# Altium project PCB_projektas.PrjPcb
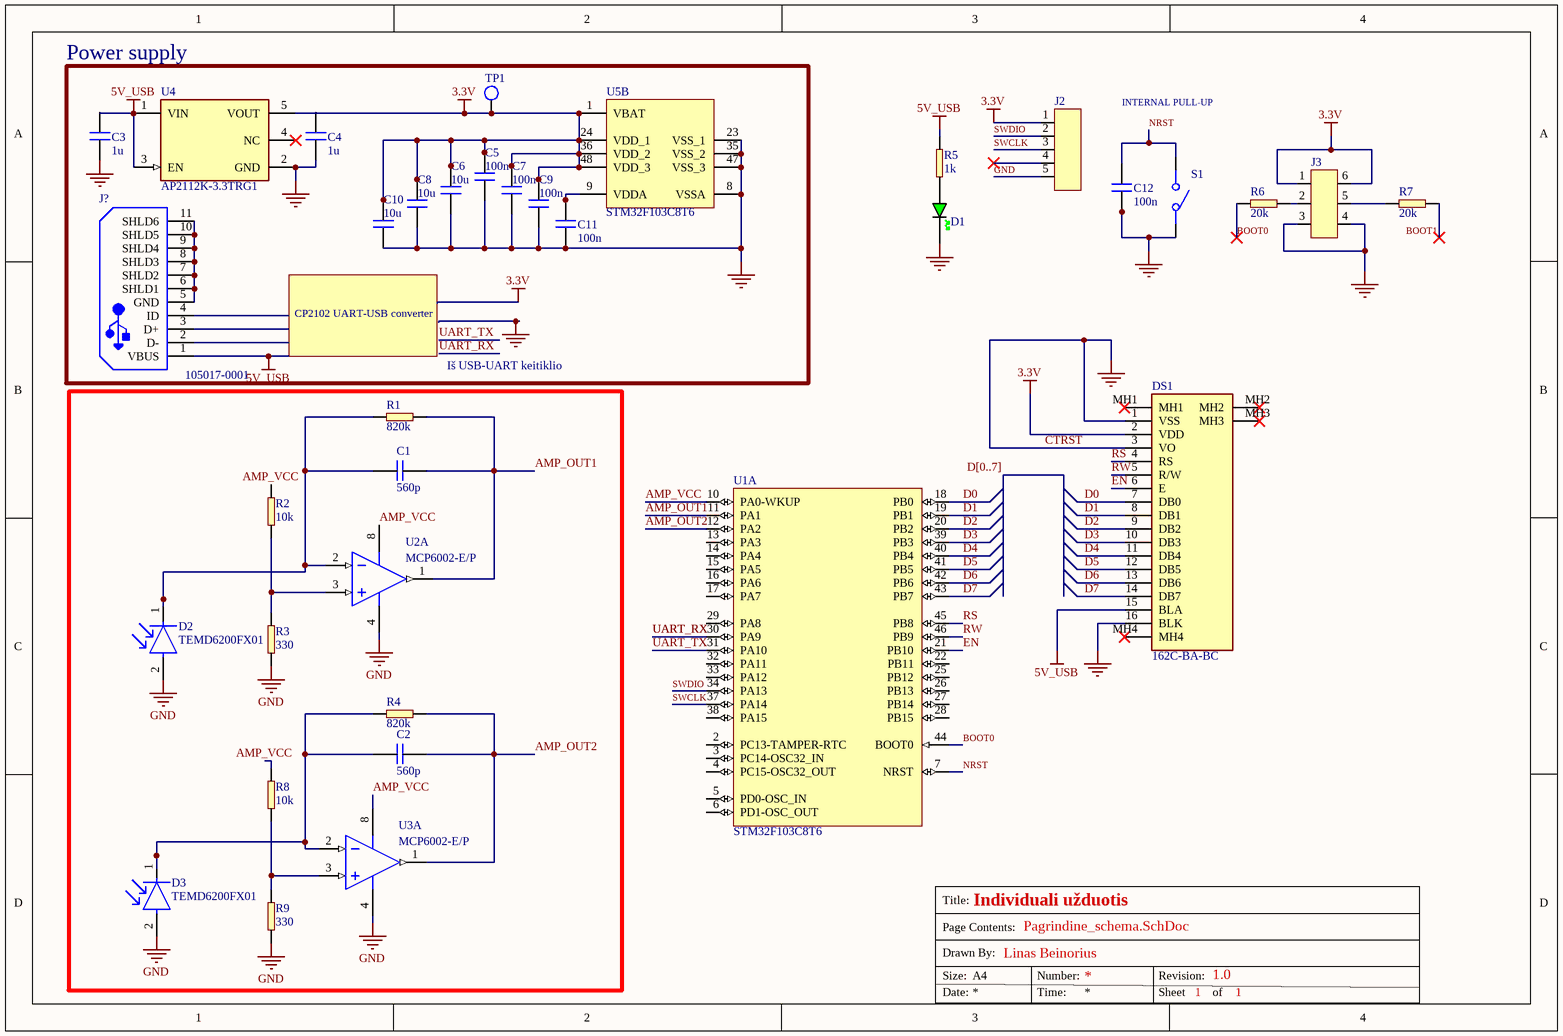
[diagram p0: Pagrindine_schema.SchDoc]
1 sheet, 36 parts. Net scope: global (net labels, ports and power ports of the same name join across sheets).
Board file: PCB_isdestymas.PcbDoc

## Sheet Pagrindine_schema.SchDoc
size A4; Author: Linas Beinorius; DrawnBy: Linas Beinorius; Revision: 1; SheetNumber: 1; SheetTotal: 1; Project: Individuali užduotis; TotalSheet: 1; VersionRevision: 1.0

### Parts
?  SCHEMATIC_TITLE  (value not drawn)  (graphical)
C1  560p  [CAP 0805_2012]
C2  560p  [CAP 0805_2012]
C3  1u  [CAP 0805_2012]
C4  1u  [CAP 0805_2012]
C5  100n  [CAP 0805_2012]
C6  10u  [CAP 0805_2012]
C7  100n  [CAP 0805_2012]
C8  10u  [CAP 0805_2012]
C9  100n  [CAP 0805_2012]
C10  10u  [CAP 0805_2012]
C11  100n  [CAP 0805_2012]
C12  100n  [CAP 0805_2012]
D1  GREEN  [LED_0805_GREEN]  (value not drawn)
D2  TEMD6200FX01  [FP-6_541-5064_01-4-MFG]
D3  TEMD6200FX01  [FP-6_541-5064_01-4-MFG]
DS1  162C-BA-BC  [162CBABC]
J2  dupont header 5x1 2.54mm pitch  [Dupont 5x1]  (value not drawn)
J3  dupont header 3x2 2.54mm pitch  [Dupont 3x2]  (value not drawn)
J?  105017-0001  [USB-MICRO-B_V]
R1  820k  [RES_0805]
R2  10k  [RES_0805]
R3  330  [RES_0805]
R4  820k  [RES_0805]
R5  1k  [RES_0805]
R6  20k  [RES_0805]
R7  20k  [RES_0805]
R8  10k  [RES_0805]
R9  330  [RES_0805]
S1  TS02-66-60-BK-260-LCR-D  [Tactile_switch 6x6x6mm]  (value not drawn)
TP1  3.3V  [TP_OVAL]  (value not drawn)
U1  STM32F103C8T6  [STM-LQFP48_L]  (part A of 2)
U2  MCP6002-E/P  [PDIP300-P8]  (part A of 2)
U3  MCP6002-E/P  [PDIP300-P8]  (part A of 2)
U4  AP2112K-3.3TRG1  [FP-SOT25-IPC_A]
U5  STM32F103C8T6  [STM-LQFP48_L]  (part B of 2)

### Blocks framed on the sheet
Power supply: C3-C11 J? TP1 U4 U5
Iš USB-UART keitiklio: C1 C2 D2 D3 R1-R4 R8 R9 U2 U3

### Nets
3.3V: C5.2 C6.2 C7.2 C8.2 C9.2 C10.2 DS1.2(VDD) J2.1 J3.1 J3.6 TP1.1 U4.5(VOUT) U5.1(VBAT) U5.24(VDD_1) U5.36(VDD_2) U5.48(VDD_3)
5V_USB: DS1.15(BLA) J?.1(VBUS) R5.2 U4.1(VIN) U4.3(EN)
CTRST: C3.1 C4.1 C5.1 C6.1 C7.1 C8.1 C9.1 C10.1 C11.1 C12.1 D1.K D2.2(A) D3.2(A) DS1.1(VSS) DS1.3(VO) DS1.16(BLK) J2.5 J3.3 J3.4 R3.1 R9.1 S1.2 U2.4(VSS) U3.4(VSS) U4.2(GND) U5.8(VSSA) U5.23(VSS_1) U5.35(VSS_2) U5.47(VSS_3)  [also labelled GND]
AMP_OUT1: C1.2 R1.1 U1.11(PA1) U2.1(VOUTA)
AMP_OUT2: C2.2 R4.1 U1.12(PA2) U3.1(VOUTA)
AMP_VCC: R2.1 R8.1 U1.10(PA0-WKUP) U2.8(VDD) U3.8(VDD)
BOOT0: R6.1 U1.44(BOOT0)
BOOT1: R7.2
D0: DS1.7(DB0) U1.18(PB0)
D1: DS1.8(DB1) U1.19(PB1)
D2: DS1.9(DB2) U1.20(PB2)
D3: DS1.10(DB3) U1.39(PB3)
D4: DS1.11(DB4) U1.40(PB4)
D5: DS1.12(DB5) U1.41(PB5)
D6: DS1.13(DB6) U1.42(PB6)
D7: DS1.14(DB7) U1.43(PB7)
EN: DS1.6(E) U1.21(PB10)
NRST: C12.2 S1.1 U1.7(NRST)
RS: DS1.4(RS) U1.45(PB8)
RW: DS1.5(R/W) U1.46(PB9)
SWCLK: J2.3 U1.37(PA14)
SWDIO: J2.2 U1.34(PA13)
UART_RX: U1.30(PA9)
UART_TX: U1.31(PA10)
NetC11_2: C11.2 U5.9(VDDA)
NetD1_A: D1.A R5.1
NetD2_1: D2.1(C) R1.2 U2.2(VINA-)
NetD3_1: D3.1(C) R4.2 U3.2(VINA-)
NetJ3_2: J3.2 R6.2
NetJ3_5: J3.5 R7.1
NetJ?_5: J?.5(GND) J?.6(SHLD1) J?.7(SHLD2) J?.8(SHLD3) J?.9(SHLD4) J?.10(SHLD5) J?.11(SHLD6)
NetR2_2: R2.2 R3.2 U2.3(VINA+)
NetR8_2: R8.2 R9.2 U3.3(VINA+)

Not connected (* = marked no-connect by the designer): C1 1; C2 1; C3 2; C4 2; DS1 MH1* MH2* MH3* MH4*; J2 4*; J? 2(D-) 3(D+) 4(ID); U1 2(PC13-TAMPER-RTC) 3(PC14-OSC32_IN) 4(PC15-OSC32_OUT) 5(PD0-OSC_IN) 6(PD1-OSC_OUT) 13(PA3) 14(PA4) 15(PA5) 16(PA6) 17(PA7) 22(PB11) 25(PB12) 26(PB13) 27(PB14) 28(PB15) 29(PA8) 32(PA11) 33(PA12) 38(PA15); U4 4(NC)*

### Buses and harness runs
bus D[0..7]

### Notes on the sheet
- INTERNAL PULL-UP
- CP2102 UART-USB converter
- (in symbol SCHEMATIC_TITLE) Title:; Page Contents:; Drawn By:; Size:; A4; Number:; Revision:; Date:; Time:; Sheet; of

### Library data of the parts
? = SCHEMATIC_TITLE: Default schematic
C1 = Capacitor: Ceramic Capacitor, Multilayer, Ceramic, 50V, 5% +Tol, 5% -Tol, C0G, -/+30ppm/Cel TC, 0.00056uF, Surface Mount, 0805; Manufacturer: KEMET; Manufacturer Part Number: C0603C561J5GACTU; Manufacturer Series: C0805C561J5GACTU; Value: 560pF; Multilayer: Yes; Capacitance: *; Tolerance: *; Rated DC Voltage (URdc): *; Size Code: *; Supplier: Mouser; Supplier Part Number: 80-C0603C561J5G; RoHS: Yes; Category: Ceramic Capacitors; Stock: 40752; Pricing: 1=0.1, 10=0.045, 50=0.045, 100=0.029, 1000=0.021, 10000=0.012 (USD); Mounting Technology: Surface Mount; Pins: 2; Dielectric Material: Ceramic; Package Shape: Rectangular; Case/Package: 0603; Terminal Finish: Nickel; Min Operating Temperature: -55°C; Max Operating Temperature: 125°C; JESD-609 Code: e3; Capacitor Type: Ceramic; Tolerance  (fill in as +-): 5%; Packaging: Tape and Reel; Tolerance (fill in as +-): 5%; Temperature Characteristics Code: C0G; Termination: Wraparound; Package Style: SMTMeter; Length: 1.6mm; Width: 0.8mm; Height: 0.8mm; Reach SVHC Compliant: Yes; RoHS Compliant: Yes; ComponentLink1URL: https://datasheet.ciiva.com:443/pdfs/VipMasterIC/IC/KEME/KEME-S-A0005605168/KEME-S-A0005605168-1.pdf?src-supplier=IHS+Markit; ComponentLink1Description: https://datasheet.ciiva.com:443/pdfs/VipMasterIC/IC/KEME/KEME-S-A0005605168/KEME-S-A0005605168-1.pdf?src-supplier=IHS+Markit; ComponentLink2URL: https://datasheet.ciiva.com:443/pdfs/VipMasterIC/IC/KEME/KEME-S-A0007731554/KEME-S-A0007733310-1.pdf?src-supplier=IHS+Markit; ComponentLink2Description: https://datasheet.ciiva.com:443/pdfs/VipMasterIC/IC/KEME/KEME-S-A0007731554/KEME-S-A0007733310-1.pdf?src-supplier=IHS+Markit; ComponentLink3URL: https://datasheet.ciiva.com/7842/1372242-7842621.pdf?src-supplier=Element14; ComponentLink3Description: https://datasheet.ciiva.com/7842/1372242-7842621.pdf?src-supplier=Element14; ComponentLink4URL: https://datasheet.ciiva.com/14599/70095383-14599884.pdf?src-supplier=Allied+Electronics; ComponentLink4Description: https://datasheet.ciiva.com/14599/70095383-14599884.pdf?src-supplier=Allied+Electronics
C2 = Capacitor: Ceramic Capacitor, Multilayer, Ceramic, 50V, 5% +Tol, 5% -Tol, C0G, -/+30ppm/Cel TC, 0.00056uF, Surface Mount, 0805; Manufacturer: KEMET; Manufacturer Part Number: C0805C561J5GACTU; Value: 560pF; Multilayer: Yes; Capacitance: *; Tolerance: *; Rated DC Voltage (URdc): *; Size Code: *; Supplier: Mouser; Supplier Part Number: 80-C0805C561J5G; RoHS: Yes; Category: Ceramic Capacitors; Stock: 12009; Pricing: 1=0.12, 10=0.072, 50=0.072, 100=0.047, 1000=0.032, 10000=0.02 (USD); Mounting Technology: Surface Mount; Pins: 2; Dielectric Material: Ceramic; Case/Package: 0805; Terminal Finish: Nickel; Package Shape: Rectangular; Min Operating Temperature: -55°C; Max Operating Temperature: 125°C; JESD-609 Code: e3; Capacitor Type: Ceramic; Tolerance  (fill in as +-): 5%; Packaging: Tape and Reel; Tolerance (fill in as +-): 5%; Temperature Characteristics Code: C0G; Termination: Wraparound; Manufacturer Series: C0805C561J5GACTU; Reach SVHC Compliant: Yes; RoHS Compliant: Yes; ComponentLink1URL: https://datasheet.ciiva.com:443/pdfs/VipMasterIC/IC/KEME/KEME-S-A0007731554/KEME-S-A0007733310-1.pdf?src-supplier=IHS+Markit; ComponentLink1Description: https://datasheet.ciiva.com:443/pdfs/VipMasterIC/IC/KEME/KEME-S-A0007731554/KEME-S-A0007733310-1.pdf?src-supplier=IHS+Markit; ComponentLink2URL: https://datasheet.ciiva.com/7842/1372242-7842621.pdf?src-supplier=Element14; ComponentLink2Description: https://datasheet.ciiva.com/7842/1372242-7842621.pdf?src-supplier=Element14; ComponentLink3URL: https://datasheet.ciiva.com/14599/70095383-14599884.pdf?src-supplier=Allied+Electronics; ComponentLink3Description: https://datasheet.ciiva.com/14599/70095383-14599884.pdf?src-supplier=Allied+Electronics
C3 C4 = Capacitor: Ceramic Capacitor, Multilayer, Ceramic, 10V, 10% +Tol, 10% -Tol, X7R, 15% TC, 1uF, Surface Mount, 0805; Manufacturer: Yageo; Manufacturer Part Number: CC0805KKX7R6BB105; Multilayer: Yes; Capacitance: *; Tolerance: *; Rated DC Voltage (URdc): *; Size Code: *; Supplier: Avnet; Supplier Part Number: 68R4879; RoHS: Yes; Category: Ceramic Capacitors; Stock: 1232; Pricing: 1=0.079 (USD); Mounting Technology: Surface Mount; Pins: 2; Dielectric Material: Ceramic; Package Shape: Rectangular; Case/Package: 0805; Terminal Finish: Nickel; Min Operating Temperature: -55°C; Max Operating Temperature: 125°C; JESD-609 Code: e3; Value: 1uF; Capacitor Type: Ceramic; Tolerance  (fill in as +-): 10%; Packaging: Tape and Reel; Tolerance (fill in as +-): 10%; Temperature Characteristics Code: X7R; Termination: Wraparound; Package Style: SMTMeter; Length: 2mm; Width: 1.25mm; Height: 1.25mm; Reach SVHC Compliant: Yes; RoHS Compliant: Yes; ComponentLink1URL: https://datasheet.ciiva.com:443/pdfs/VipMasterIC/IC/YAGO/YAGO-S-A0003557223/YAGO-S-A0003557223-1.pdf?src-supplier=IHS+Markit; ComponentLink1Description: https://datasheet.ciiva.com:443/pdfs/VipMasterIC/IC/YAGO/YAGO-S-A0003557223/YAGO-S-A0003557223-1.pdf?src-supplier=IHS+Markit
C5 C7 C9 C11 C12 = Capacitor: Ceramic Capacitor, Multilayer, Ceramic, 50V, 10% +Tol, 10% -Tol, X7R, 15% TC, 0.1uF, Surface Mount, 0805; Manufacturer: KEMET; Manufacturer Part Number: C0402C104K8PACTU; Value: 100nF; Multilayer: Yes; Temperature Characteristics Code: X5R; Capacitance: *; Tolerance: *; Rated DC Voltage (URdc): *; Size Code: *; Supplier: Mouser; Supplier Part Number: 80-C0402C104K8P; RoHS: Yes; Category: Ceramic Capacitors; Stock: 545712; Pricing: 1=0.1, 10=0.025, 50=0.025, 100=0.015, 1000=0.011, 10000=0.005 (USD); Mounting Technology: Surface Mount; Pins: 2; Dielectric Material: Ceramic; Package Shape: Rectangular; Case/Package: 0402; Terminal Finish: Nickel; Min Operating Temperature: -55°C; Max Operating Temperature: 85°C; JESD-609 Code: e3; Capacitor Type: Ceramic; Tolerance  (fill in as +-): 10%; Package Style: SMTMeter; Packaging: Tape and Reel; Tolerance (fill in as +-): 10%; Termination: Wraparound; Length: 1mm; Width: 0.5mm; Height: 0.5mm; Reach SVHC Compliant: Yes; RoHS Compliant: Yes; ComponentLink1URL: https://datasheet.ciiva.com:443/pdfs/VipMasterIC/IC/KEME/KEME-S-A0008991665/KEME-S-A0008991665-1.pdf?src-supplier=IHS+Markit; ComponentLink1Description: https://datasheet.ciiva.com:443/pdfs/VipMasterIC/IC/KEME/KEME-S-A0008991665/KEME-S-A0008991665-1.pdf?src-supplier=IHS+Markit; ComponentLink2URL: https://datasheet.ciiva.com/144/docfinderpartnumber-c0402c104k8pactu-144097.pdf?src-supplier=Digikey; ComponentLink2Description: https://datasheet.ciiva.com/144/docfinderpartnumber-c0402c104k8pactu-144097.pdf?src-supplier=Digikey; ComponentLink3URL: https://datasheet.ciiva.com/7747/1776086-7747440.pdf?src-supplier=Element14; ComponentLink3Description: https://datasheet.ciiva.com/7747/1776086-7747440.pdf?src-supplier=Element14; ComponentLink4URL: https://datasheet.ciiva.com/28645/1789732-28645387.pdf?src-supplier=Element14; ComponentLink4Description: https://datasheet.ciiva.com/28645/1789732-28645387.pdf?src-supplier=Element14; ComponentLink5URL: https://datasheet.ciiva.com/14588/70095383-14588187.pdf?src-supplier=Allied+Electronics; ComponentLink5Description: https://datasheet.ciiva.com/14588/70095383-14588187.pdf?src-supplier=Allied+Electronics; ComponentLink6URL: https://datasheet.ciiva.com/14595/70095383-14595064.pdf?src-supplier=Allied+Electronics; ComponentLink6Description: https://datasheet.ciiva.com/14595/70095383-14595064.pdf?src-supplier=Allied+Electronics; ComponentLink7URL: https://datasheet.ciiva.com:443/pdfs/VipMasterIC/IC/YAGO/YAGO-S-A0003557223/YAGO-S-A0003557223-1.pdf?src-supplier=IHS+Markit; ComponentLink7Description: https://datasheet.ciiva.com:443/pdfs/VipMasterIC/IC/YAGO/YAGO-S-A0003557223/YAGO-S-A0003557223-1.pdf?src-supplier=IHS+Markit; ComponentLink8URL: https://datasheet.ciiva.com/11786/0900766b80d84f1d-11786009.pdf?src-supplier=Rs; ComponentLink8Description: https://datasheet.ciiva.com/11786/0900766b80d84f1d-11786009.pdf?src-supplier=Rs; ComponentLink9URL: https://datasheet.ciiva.com/11464/upy-gphc-x7r-6-3v-to-50v-8-11464757.pdf?src-supplier=Avnet; ComponentLink9Description: https://datasheet.ciiva.com/11464/upy-gphc-x7r-6-3v-to-50v-8-11464757.pdf?src-supplier=Avnet; ComponentLink10URL: https://datasheet.ciiva.com/155/mlccorderingcode-155930.pdf?src-supplier=Digikey; ComponentLink10Description: https://datasheet.ciiva.com/155/mlccorderingcode-155930.pdf?src-supplier=Digikey; ComponentLink11URL: https://datasheet.ciiva.com/28450/1489800-28450805.pdf?src-supplier=Element14; ComponentLink11Description: https://datasheet.ciiva.com/28450/1489800-28450805.pdf?src-supplier=Element14; ComponentLink12URL: https://datasheet.ciiva.com/46393/1734573-46393307.pdf?src-supplier=Element14; ComponentLink12Description: https://datasheet.ciiva.com/46393/1734573-46393307.pdf?src-supplier=Element14; ComponentLink13URL: https://datasheet.ciiva.com/155/mlccorderingcode-155929.pdf?src-supplier=Digikey; ComponentLink13Description: https://datasheet.ciiva.com/155/mlccorderingcode-155929.pdf?src-supplier=Digikey; ComponentLink14URL: https://datasheet.ciiva.com/155/mlccorderingcode-155931.pdf?src-supplier=Digikey; ComponentLink14Description: https://datasheet.ciiva.com/155/mlccorderingcode-155931.pdf?src-supplier=Digikey; ComponentLink15URL: https://datasheet.ciiva.com/29242/445210-da-01-en-kerko-chip-0805-x7r-0-1uf-10proz-50vg-29242074.pdf?src-supplier=Conrad; ComponentLink15Description: https://datasheet.ciiva.com/29242/445210-da-01-en-kerko-chip-0805-x7r-0-1uf-10proz-50vg-29242074.pdf?src-supplier=Conrad
C6 C8 C10 = Capacitor: Ceramic Capacitor, Multilayer, Ceramic, 25V, 10% +Tol, 10% -Tol, X5R, 15% TC, 10uF, Surface Mount, 0805; Manufacturer: Murata; Manufacturer Part Number: GRM21BR61E106KA73L; Multilayer: Yes; Capacitance: *; Tolerance: *; Rated DC Voltage (URdc): *; Size Code: *; Supplier: Mouser; Supplier Part Number: 81-GRM21BR61E106KA3L; RoHS: Yes; Category: Ceramic Capacitors; Stock: 273323; Pricing: 1=0.15, 10=0.044, 50=0.044, 100=0.041, 1000=0.041, 10000=0.03 (USD); Mounting Technology: Surface Mount; Pins: 2; Dielectric Material: Ceramic; Package Shape: Rectangular; Case/Package: 0805; Terminal Finish: Nickel; Min Operating Temperature: -55°C; Max Operating Temperature: 85°C; JESD-609 Code: e3; Value: 10uF; Capacitor Type: Ceramic; Tolerance  (fill in as +-): 10%; Package Style: SMTMeter; Packaging: Tape and Reel; Tolerance (fill in as +-): 10%; Temperature Characteristics Code: X5R; Termination: Wraparound; Length: 2mm; Width: 1.25mm; Height: 1.25mm; Reach SVHC Compliant: Yes; RoHS Compliant: Yes; ComponentLink1URL: https://datasheet.ciiva.com:443/pdfs/VipMasterIC/IC/MURE/MURE-S-A0008911298/MURE-S-A0008911412-1.pdf?src-supplier=IHS+Markit; ComponentLink1Description: https://datasheet.ciiva.com:443/pdfs/VipMasterIC/IC/MURE/MURE-S-A0008911298/MURE-S-A0008911412-1.pdf?src-supplier=IHS+Markit
D1 = LED_0805_GREEN: Single Color LED, Green, Water Clear, 1.4mm; Shape: Rectangular; Forward Current: 30mA; Luminous Intensity-Nom: 450mcd; Channels: 1; Viewing Angle: 140°; Overall Height: 0.7mm; Manufacturer: *; Manufacturer Part Number: *; Distributor Link: *; LCSC: *; Supplier: Mouser; Supplier Part Number: 710-150080GS75000; RoHS: Yes; Category: LEDs; Stock: 72768; Pricing: 1=0.19, 10=0.187, 50=0.176, 100=0.151, 1000=0.138, 10000=0.138 (USD); Mounting Technology: Surface Mount; Pins: 2; Color: Green; Min Operating Temperature: -40°C; Max Operating Temperature: 85°C; Lens Style: WATER CLEAR; Optoelectronic Device Type: SINGLE COLOR LED; Packaging: Tape and Reel; Size: 1.4mm; Terminal Pitch: 2.1mm; Reach SVHC Compliant: Yes; RoHS Compliant: Yes; ComponentLink1URL: https://datasheet.ciiva.com:443/pdfs/VipMasterIC/IC/MIDC/MIDC-S-A0007455966/MIDC-S-A0007455966-1.pdf?src-supplier=IHS+Markit; ComponentLink1Description: https://datasheet.ciiva.com:443/pdfs/VipMasterIC/IC/MIDC/MIDC-S-A0007455966/MIDC-S-A0007455966-1.pdf?src-supplier=IHS+Markit; ComponentLink2URL: https://datasheet.ciiva.com/29563/150080gs75000-29563008.pdf?src-supplier=Digikey; ComponentLink2Description: https://datasheet.ciiva.com/29563/150080gs75000-29563008.pdf?src-supplier=Digikey; ComponentLink3URL: https://datasheet.ciiva.com/29279/759434-da-01-en-chipled-0805-w-kl-gruen-150080gs75000-29279039.pdf?src-supplier=Conrad; ComponentLink3Description: https://datasheet.ciiva.com/29279/759434-da-01-en-chipled-0805-w-kl-gruen-150080gs75000-29279039.pdf?src-supplier=Conrad
D2 D3 = CMP-02531-000004-1: SENSOR PHOTODIODE 540NM 0805; Manufacturer: Vishay; Viewing Angle: 120°; Dark Current: 0.0001uA; Automotive Grade: Grade 3; Max Junction Temp: +100°C; Reverse Breakdown Voltage: 16V; Power Dissipation: 100mW; Device Class L3: Photodiodes; ComponentLink2URL: http://www.vishay.com/docs/81812/temd6200.pdf; Sensor Output: Photodiode; Mouser Description: Ambient Light Sensors 16V 100mW 60Deg AEC-Q101 Qualified; Temperature: -40°C to +100°C; Temperature Range Low: -40°C; Device Class L2: Optical Sensors; ComponentLink2Description: Datasheet; Ambient Temperature Range Low: -40°C; Package: 6.541-5064.01-4; Device Class L1: Sensors; Octopart: https://octopart.com/temd6200fx01-vishay-19158932; Ambient Temperature Range High: +100°C; Category: Diode; Height: 0.95mm; Digikey Description: SENSOR PHOTODIODE 540NM 0805; Lead Free: Yes; RoHS: TRUE; Manufacturer Part Number: TEMD6200FX01; Automotive: Yes; Temperature Range High: +100°C
DS1 = 162C-BA-BC: Display; Manufacturer_Name: Displaytech; Datasheet Link: http://uk.rs-online.com/web/p/products/1775379; Height: 5mm; Manufacturer_Part_Number: 162C-BA-BC
J2 = Dupont header 5x1_1
J3 = Dupont header 3x2
J? = CMP-2000-05827-1: Micro-USB B Receptacle, Right Angle, Bottom Mount, Surface Mount, with Solder Tabs, -30 to 85 degC, 5-Pin USB, RoHS, Tape and Reel; Manufacturer: Molex; Featured Product: Micro-USBConnectorsUSBConnectors; Other Names: WM1399DKR; Package Version: Rev. F, 12/2012; Number of Contacts: 5; Connector Type: USB-microB; Catalog Drawings: 1050170001; 3D Model: 105017-0001.stp; Mating Products: WM17145-ND-CABLEMICROUSBBTOSTDA1.0MWM17147-ND-CABLEMICROUSBBTOSTDA2.0MWM17146-ND-CABLEMICROUSBBTOSTDA1.5M; PCN Assembly/Origin: ResinSupplier21/Oct/2015; Voltage - Max: 30V; Online Catalog: Molex-MicroUSB; Manufacturer URL: http://www.molex.com/; Package Description: 5-Leads USB, Micro B, Body 7.5 x 5 mm, Pitch 0.65 mm; Datasheet URL: http://www.molex.com/elqNow/elqRedir.htm?ref=http://www.molex.com/webdocs/datasheets/pdf/en-us/1050170001_IO_CONNECTORS.pdf; Ingress Protection: -; Datasheet Version: 03/2016; Mounting Type: BoardCutout,SurfaceMount,RightAngle; Circuits: 5; Standard Package: 1; Package Reference: MICRO-B; Package URL: http://www.molex.com/pdm_docs/sd/1050170001_sd.pdf; Category: Connectors,Interconnects; Series: -; RoHS Information: 1050170001CertofCompliance; Features: Shielded,SolderRetention; Family: USB,DVI,HDMIConnectors; Specifications: -; Gender: Receptacle; Packaging: Digi-Reel®; Mounting Technology: SurfaceMount
R1 R4 = Resistor: Fixed Resistor, Metal Glaze/thick Film, 0.125W, 820000ohm, 150V, 1% +/-Tol, 100ppm/Cel, Surface Mount, 0805; Manufacturer: Vishay; Manufacturer Part Number: CRCW0805820KFKEA; Power: 125mW; Rated Temperature: 70°C; Value: 820kR; Temperature Coefficient (ppm/Cel): 100; Package Height: 0.45mm; Package Length: 2mm; Package Width: 1.25mm; Reference Standard: AEC-Q200; Supplier: Mouser; Supplier Part Number: 71-CRCW0805820KFKEA; RoHS: Yes; Category: Chip SMD Resistors; Stock: 12041; Pricing: 1=0.1, 10=0.025, 50=0.025, 100=0.021, 1000=0.013, 10000=0.007 (USD); Mounting Technology: Surface Mount; Pins: 2; Case/Package: 0805; Terminal Finish: Nickel; Package Shape: Rectangular; Min Operating Temperature: -55°C; Max Operating Temperature: 155°C; Tolerance: 1%; Resistor Type: FIXED RESISTOR; Construction: Chip; Packaging: Tape and Reel; Technology: METAL GLAZE/THICK FILM; Termination: Wraparound; Working Voltage: 150V; JESD-609 Code: e3; Reach SVHC Compliant: Yes; RoHS Compliant: Yes; ComponentLink1URL: https://datasheet.ciiva.com:443/pdfs/VipMasterIC/IC/VISH/VISH-S-A0007266705/VISH-S-A0007266705-1.pdf?src-supplier=IHS+Markit; ComponentLink1Description: https://datasheet.ciiva.com:443/pdfs/VipMasterIC/IC/VISH/VISH-S-A0007266705/VISH-S-A0007266705-1.pdf?src-supplier=IHS+Markit; ComponentLink2URL: https://datasheet.ciiva.com/11811/0900766b80d98b26-11811079.pdf?src-supplier=Rs; ComponentLink2Description: https://datasheet.ciiva.com/11811/0900766b80d98b26-11811079.pdf?src-supplier=Rs; ComponentLink3URL: https://datasheet.ciiva.com/2495/dcrcwe3-2495929.pdf?src-supplier=Digikey; ComponentLink3Description: https://datasheet.ciiva.com/2495/dcrcwe3-2495929.pdf?src-supplier=Digikey; ComponentLink4URL: https://datasheet.ciiva.com/2495/dcrcwe3-2495930.pdf?src-supplier=Digikey; ComponentLink4Description: https://datasheet.ciiva.com/2495/dcrcwe3-2495930.pdf?src-supplier=Digikey; ComponentLink5URL: https://datasheet.ciiva.com/2495/dcrcwe3-2495931.pdf?src-supplier=Digikey; ComponentLink5Description: https://datasheet.ciiva.com/2495/dcrcwe3-2495931.pdf?src-supplier=Digikey; ComponentLink6URL: https://datasheet.ciiva.com/5546/dcrcwe3-109170-5546905.pdf?src-supplier=Mouser; ComponentLink6Description: https://datasheet.ciiva.com/5546/dcrcwe3-109170-5546905.pdf?src-supplier=Mouser; ComponentLink7URL: https://datasheet.ciiva.com/7670/1697337-7670939.pdf?src-supplier=Element14; ComponentLink7Description: https://datasheet.ciiva.com/7670/1697337-7670939.pdf?src-supplier=Element14; ComponentLink8URL: https://datasheet.ciiva.com/7670/1697337-7670940.pdf?src-supplier=Element14; ComponentLink8Description: https://datasheet.ciiva.com/7670/1697337-7670940.pdf?src-supplier=Element14; ComponentLink9URL: https://datasheet.ciiva.com/22706/1697337-22706282.pdf?src-supplier=Element14; ComponentLink9Description: https://datasheet.ciiva.com/22706/1697337-22706282.pdf?src-supplier=Element14
R2 R8 = Resistor: Fixed Resistor, Metal Glaze/thick Film, 0.125W, 10000ohm, 150V, 1% +/-Tol, 100ppm/Cel, Surface Mount, 0805; Manufacturer: Vishay Beyschlag; Manufacturer Part Number: MBB02070C1002FCT00; Power: 400mW; Rated Temperature: 70°C; Value: 10kR; Working Voltage: 350V; Temperature Coefficient (ppm/Cel): 50; Additional Feature: RATED AC VOLTAGE: 350V; Lead Diameter: 0.6mm; Package Length: 6.5mm; Lead Length: 28mm; Reference Standard: AEC-Q200; Package Height: 0.45mm; Package Width: 1.25mm; Supplier: Mouser; Supplier Part Number: 594-MBB02070C1002FCT; RoHS: Yes; Category: Through-Hole Resistors; Stock: 25852; Pricing: 1=0.1, 10=0.078, 50=0.069, 100=0.065, 1000=0.055, 10000=0.037 (USD); Mounting Technology: Through Hole; Pins: 2; Terminal Finish: Nickel; Min Operating Temperature: -55°C; Max Operating Temperature: 125°C; Tolerance: 1%; JESD-609 Code: e3; Resistor Type: FIXED RESISTOR; Construction: Tubular; Package Style: AXIAL; Packaging: Ammo Pack; Technology: THIN FILM; Termination: Wire; Reach SVHC Compliant: Yes; RoHS Compliant: Yes; ComponentLink1URL: https://datasheet.ciiva.com:443/pdfs/VipMasterIC/IC/VISH/VISH-S-A0005972005/VISH-S-A0005972005-1.pdf?src-supplier=IHS+Markit; ComponentLink1Description: https://datasheet.ciiva.com:443/pdfs/VipMasterIC/IC/VISH/VISH-S-A0005972005/VISH-S-A0005972005-1.pdf?src-supplier=IHS+Markit; ComponentLink2URL: https://datasheet.ciiva.com/11823/0900766b803d0387-11823234.pdf?src-supplier=Rs; ComponentLink2Description: https://datasheet.ciiva.com/11823/0900766b803d0387-11823234.pdf?src-supplier=Rs; ComponentLink3URL: https://datasheet.ciiva.com/7861/b0207c-f-7861404.pdf?src-supplier=Element14; ComponentLink3Description: https://datasheet.ciiva.com/7861/b0207c-f-7861404.pdf?src-supplier=Element14; Case/Package: 0805; Package Shape: Rectangular; ComponentLink4URL: https://datasheet.ciiva.com:443/pdfs/VipMasterIC/IC/VISH/VISH-S-A0007266705/VISH-S-A0007266705-1.pdf?src-supplier=IHS+Markit; ComponentLink4Description: https://datasheet.ciiva.com:443/pdfs/VipMasterIC/IC/VISH/VISH-S-A0007266705/VISH-S-A0007266705-1.pdf?src-supplier=IHS+Markit; ComponentLink5URL: https://datasheet.ciiva.com/11808/0900766b80d98b26-11808216.pdf?src-supplier=Rs; ComponentLink5Description: https://datasheet.ciiva.com/11808/0900766b80d98b26-11808216.pdf?src-supplier=Rs; ComponentLink6URL: https://datasheet.ciiva.com/46394/1720486-46394381.pdf?src-supplier=Element14; ComponentLink6Description: https://datasheet.ciiva.com/46394/1720486-46394381.pdf?src-supplier=Element14; ComponentLink7URL: https://datasheet.ciiva.com/16719/70201119-16719082.pdf?src-supplier=Allied+Electronics; ComponentLink7Description: https://datasheet.ciiva.com/16719/70201119-16719082.pdf?src-supplier=Allied+Electronics; ComponentLink8URL: https://datasheet.ciiva.com/16755/70201119-16755389.pdf?src-supplier=Allied+Electronics; ComponentLink8Description: https://datasheet.ciiva.com/16755/70201119-16755389.pdf?src-supplier=Allied+Electronics; ComponentLink9URL: https://datasheet.ciiva.com/5547/dcrcwe3-109170-5547559.pdf?src-supplier=Mouser; ComponentLink9Description: https://datasheet.ciiva.com/5547/dcrcwe3-109170-5547559.pdf?src-supplier=Mouser; ComponentLink10URL: https://datasheet.ciiva.com/8337/dcrcwe3-8337774.pdf?src-supplier=Avnet; ComponentLink10Description: https://datasheet.ciiva.com/8337/dcrcwe3-8337774.pdf?src-supplier=Avnet
R3 R9 = Resistor: Fixed Resistor, Metal Glaze/thick Film, 0.125W, 330ohm, 150V, 1% +/-Tol, 100ppm/Cel, Surface Mount, 0805; Manufacturer: TE Connectivity; Manufacturer Part Number: CFR50J330R; Manufacturer Series: CFR; Tolerance: 5%; Power: 500mW; Value: 330R; Working Voltage: 350V; Rated Temperature: 70°C; Temperature Coefficient (ppm/Cel): 450; Lead Diameter: 0.54mm; Package Length: 9mm; Package Height: 0.45mm; Package Width: 1.25mm; Reference Standard: AEC-Q200; Supplier: Mouser; Supplier Part Number: 279-CFR50J330R; RoHS: Yes; Category: Through-Hole Resistors; Stock: 7931; Pricing: 1=0.1, 10=0.065, 50=0.048, 100=0.043, 1000=0.029, 10000=0.017 (USD); Mounting Technology: Through Hole; Pins: 2; Package Shape: Tubular; Terminal Finish: Tin; Min Operating Temperature: -55°C; Max Operating Temperature: 155°C; Resistor Type: FIXED RESISTOR; Construction: Cylindrical; Package Style: AXIAL; Packaging: Ammo Pack; Technology: CARBON FILM; JESD-609 Code: e3; Termination: Wire; Series: CFR; Reach SVHC Compliant: Yes; RoHS Compliant: Yes; ComponentLink1URL: https://datasheet.ciiva.com:443/pdfs/VipMasterIC/IC/TYEL/TYEL-S-A0009531935/TYEL-S-A0009536771-1.pdf?src-supplier=IHS+Markit; ComponentLink1Description: https://datasheet.ciiva.com:443/pdfs/VipMasterIC/IC/TYEL/TYEL-S-A0009531935/TYEL-S-A0009536771-1.pdf?src-supplier=IHS+Markit; ComponentLink2URL: https://datasheet.ciiva.com/11823/0900766b80098b49-11823751.pdf?src-supplier=Rs; ComponentLink2Description: https://datasheet.ciiva.com/11823/0900766b80098b49-11823751.pdf?src-supplier=Rs; ComponentLink3URL: https://datasheet.ciiva.com/30211/eng-ds-1773195-d-30211324.pdf?src-supplier=Onlinecomponents.com; ComponentLink3Description: https://datasheet.ciiva.com/30211/eng-ds-1773195-d-30211324.pdf?src-supplier=Onlinecomponents.com; ComponentLink4URL: https://datasheet.ciiva.com/16781/70063023-16781994.pdf?src-supplier=Allied+Electronics; ComponentLink4Description: https://datasheet.ciiva.com/16781/70063023-16781994.pdf?src-supplier=Allied+Electronics; Case/Package: 0805; ComponentLink5URL: https://datasheet.ciiva.com:443/pdfs/VipMasterIC/IC/VISH/VISH-S-A0007266705/VISH-S-A0007266705-1.pdf?src-supplier=IHS+Markit; ComponentLink5Description: https://datasheet.ciiva.com:443/pdfs/VipMasterIC/IC/VISH/VISH-S-A0007266705/VISH-S-A0007266705-1.pdf?src-supplier=IHS+Markit; ComponentLink6URL: https://datasheet.ciiva.com/2495/dcrcwe3-2495803.pdf?src-supplier=Digikey; ComponentLink6Description: https://datasheet.ciiva.com/2495/dcrcwe3-2495803.pdf?src-supplier=Digikey; ComponentLink7URL: https://datasheet.ciiva.com/16769/70201119-16769852.pdf?src-supplier=Allied+Electronics; ComponentLink7Description: https://datasheet.ciiva.com/16769/70201119-16769852.pdf?src-supplier=Allied+Electronics; ComponentLink8URL: https://datasheet.ciiva.com/5545/dcrcwe3-109170-5545357.pdf?src-supplier=Mouser; ComponentLink8Description: https://datasheet.ciiva.com/5545/dcrcwe3-109170-5545357.pdf?src-supplier=Mouser; ComponentLink9URL: https://datasheet.ciiva.com/8944/dcrcwe3-8944773.pdf?src-supplier=Avnet; ComponentLink9Description: https://datasheet.ciiva.com/8944/dcrcwe3-8944773.pdf?src-supplier=Avnet; ComponentLink10URL: https://datasheet.ciiva.com/7777/1697337-7777390.pdf?src-supplier=Element14; ComponentLink10Description: https://datasheet.ciiva.com/7777/1697337-7777390.pdf?src-supplier=Element14; ComponentLink11URL: https://datasheet.ciiva.com/2495/dcrcwe3-2495804.pdf?src-supplier=Digikey; ComponentLink11Description: https://datasheet.ciiva.com/2495/dcrcwe3-2495804.pdf?src-supplier=Digikey; ComponentLink12URL: https://datasheet.ciiva.com/2495/dcrcwe3-2495805.pdf?src-supplier=Digikey; ComponentLink12Description: https://datasheet.ciiva.com/2495/dcrcwe3-2495805.pdf?src-supplier=Digikey; ComponentLink13URL: https://datasheet.ciiva.com/8944/dcrcwe3-8944776.pdf?src-supplier=Avnet; ComponentLink13Description: https://datasheet.ciiva.com/8944/dcrcwe3-8944776.pdf?src-supplier=Avnet; ComponentLink14URL: https://datasheet.ciiva.com/7777/1720486-7777573.pdf?src-supplier=Element14; ComponentLink14Description: https://datasheet.ciiva.com/7777/1720486-7777573.pdf?src-supplier=Element14
R5 = Resistor: Fixed Resistor, Metal Glaze/thick Film, 0.125W, 1000ohm, 150V, 1% +/-Tol, 100ppm/Cel, Surface Mount, 0805; Manufacturer: Yageo; Manufacturer Part Number: RC0805FR-071KL; Power: 125mW; Rated Temperature: 70°C; Value: 1kR; Temperature Coefficient (ppm/Cel): 100; Additional Feature: LASER TRIMMABLE; Package Height: 0.5mm; Package Length: 2mm; Package Width: 1.25mm; Supplier: Future Electronics; Supplier Part Number: 8126013; RoHS: Yes; Category: Chip SMD Resistors; Stock: 3880000; Pricing: 5000=0.0017, 25000=0.0016, 125000=0.0015, 375000=0.0015, 1000000=0.0014 (USD); Mounting Technology: Surface Mount; Pins: 2; Package Shape: Rectangular; Case/Package: 0805; Terminal Finish: Nickel; Min Operating Temperature: -55°C; Max Operating Temperature: 155°C; Tolerance: 1%; JESD-609 Code: e3; Resistor Type: FIXED RESISTOR; Construction: Chip; Packaging: Tape and Reel; Technology: METAL GLAZE/THICK FILM; Termination: Wraparound; Working Voltage: 150V; Reach SVHC Compliant: Yes; RoHS Compliant: Yes; ComponentLink1URL: https://datasheet.ciiva.com:443/pdfs/VipMasterIC/IC/YAGO/YAGO-S-A0008145938/YAGO-S-A0008145938-1.pdf?src-supplier=IHS+Markit; ComponentLink1Description: https://datasheet.ciiva.com:443/pdfs/VipMasterIC/IC/YAGO/YAGO-S-A0008145938/YAGO-S-A0008145938-1.pdf?src-supplier=IHS+Markit
R6 R7 = Resistor: Fixed Resistor, Metal Glaze/thick Film, 0.125W, 20000ohm, 150V, 1% +/-Tol, 100ppm/Cel, Surface Mount, 0805; Manufacturer: Vishay; Manufacturer Part Number: CRCW080520K0FKEA; Power: 125mW; Rated Temperature: 70°C; Value: 20kR; Temperature Coefficient (ppm/Cel): 100; Package Height: 0.45mm; Package Length: 2mm; Package Width: 1.25mm; Reference Standard: AEC-Q200; Supplier: Mouser; Supplier Part Number: 71-CRCW0805-20K-E3; RoHS: Yes; Category: Chip SMD Resistors; Stock: 127016; Pricing: 1=0.1, 10=0.025, 50=0.025, 100=0.021, 1000=0.013, 10000=0.007 (USD); Mounting Technology: Surface Mount; Pins: 2; Case/Package: 0805; Terminal Finish: Nickel; Package Shape: Rectangular; Min Operating Temperature: -55°C; Max Operating Temperature: 155°C; Tolerance: 1%; JESD-609 Code: e3; Resistor Type: FIXED RESISTOR; Construction: Chip; Packaging: Tape and Reel; Technology: METAL GLAZE/THICK FILM; Termination: Wraparound; Working Voltage: 150V; Reach SVHC Compliant: Yes; RoHS Compliant: Yes; ComponentLink1URL: https://datasheet.ciiva.com:443/pdfs/VipMasterIC/IC/VISH/VISH-S-A0007266705/VISH-S-A0007266705-1.pdf?src-supplier=IHS+Markit; ComponentLink1Description: https://datasheet.ciiva.com:443/pdfs/VipMasterIC/IC/VISH/VISH-S-A0007266705/VISH-S-A0007266705-1.pdf?src-supplier=IHS+Markit; ComponentLink2URL: https://datasheet.ciiva.com/11810/0900766b80d98b26-11810856.pdf?src-supplier=Rs; ComponentLink2Description: https://datasheet.ciiva.com/11810/0900766b80d98b26-11810856.pdf?src-supplier=Rs; ComponentLink3URL: https://datasheet.ciiva.com/7841/1720486-7841886.pdf?src-supplier=Element14; ComponentLink3Description: https://datasheet.ciiva.com/7841/1720486-7841886.pdf?src-supplier=Element14; ComponentLink4URL: https://datasheet.ciiva.com/8337/dcrcwe3-8337655.pdf?src-supplier=Avnet; ComponentLink4Description: https://datasheet.ciiva.com/8337/dcrcwe3-8337655.pdf?src-supplier=Avnet; ComponentLink5URL: https://datasheet.ciiva.com/16199/dcrcwe3-16199237.pdf?src-supplier=Future+Electronics; ComponentLink5Description: https://datasheet.ciiva.com/16199/dcrcwe3-16199237.pdf?src-supplier=Future+Electronics; ComponentLink6URL: https://datasheet.ciiva.com/26317/fld-crcw-e3-data-en-26317160.pdf?src-supplier=Distrelec; ComponentLink6Description: https://datasheet.ciiva.com/26317/fld-crcw-e3-data-en-26317160.pdf?src-supplier=Distrelec; ComponentLink7URL: https://datasheet.ciiva.com/2467/dcrcwe3-2467198.pdf?src-supplier=Digikey; ComponentLink7Description: https://datasheet.ciiva.com/2467/dcrcwe3-2467198.pdf?src-supplier=Digikey; ComponentLink8URL: https://datasheet.ciiva.com/2467/dcrcwe3-2467199.pdf?src-supplier=Digikey; ComponentLink8Description: https://datasheet.ciiva.com/2467/dcrcwe3-2467199.pdf?src-supplier=Digikey; ComponentLink9URL: https://datasheet.ciiva.com/2467/dcrcwe3-2467197.pdf?src-supplier=Digikey; ComponentLink9Description: https://datasheet.ciiva.com/2467/dcrcwe3-2467197.pdf?src-supplier=Digikey; ComponentLink10URL: https://datasheet.ciiva.com/16779/70201119-16779384.pdf?src-supplier=Allied+Electronics; ComponentLink10Description: https://datasheet.ciiva.com/16779/70201119-16779384.pdf?src-supplier=Allied+Electronics; ComponentLink11URL: https://datasheet.ciiva.com/5562/dcrcwe3-109170-5562293.pdf?src-supplier=Mouser; ComponentLink11Description: https://datasheet.ciiva.com/5562/dcrcwe3-109170-5562293.pdf?src-supplier=Mouser
S1 = Tactile switch: 6 x 6 mm, 6 mm Actuator Height, 260 gf, Black, Long Crimped, Through Hole, SPST, Tactile Switch; MF: CUI Devices; Price: None; Component Type: Standard; Value: *; Availability: In Stock; Check_prices: https://www.snapeda.com/parts/TS02-66-60-BK-260-LCR-D/CUI+Devices/view-part/?ref=eda; Pin Count: 4; Purchase-URL: https://pricing.snapeda.com/search/part/TS02-66-60-BK-260-LCR-D/?ref=eda; Design Item ID: TS02-66-60-BK-260-LCR-D; SnapEDA_Link: https://www.snapeda.com/parts/TS02-66-60-BK-260-LCR-D/CUI+Devices/view-part/?ref=snap; Package: None; CUI_purchase_URL: https://www.cuidevices.com/product/switches/tactile-switches/ts02-series?utm_source=snapeda.com&utm_medium=referral&utm_campaign=snapedaBOM; MP: TS02-66-60-BK-260-LCR-D; Source: TS02-66-60-BK-260-LCR-D.SchLib
TP1 = Test_point_pad: Test points for PCB
U1 U5 = CMP-0237-00215-3: ARM Cortex-M3 32-bit MCU, 64 KB Flash, 20 KB Internal RAM, 37 I/Os, 48-pin LQFP, -40 to 85 degC, Tray; Supply Voltage(Vcc) min (V): 2; Internal RAM Size (kB): 20; FLASH Size (Prog) (kB): 64; A/D Converter: 2x12-bit (10 Channel); I/Os (High Current): 37; Operating Frequency(F) (Processor speed) (MHz): 72; Core: ARM Cortex-M3; ComponentLink3Description: Package Specification; Mounting Technology: Surface Mount; PartNumber: STM32F103C8T6; PackageReference: LQFP48; Packing: Tray; ComponentLink3URL: http://www.st.com/st-web-ui/static/active/en/resource/technical/document/datasheet/DM00058181.pdf; DatasheetVersion: Rev. 16; ComponentLink1URL: http://www.st.com/web/en/home.html; PackageVersion: Rev. 6, 06/2013; ComponentLink2URL: http://www.st.com/st-web-ui/static/active/en/resource/technical/document/datasheet/CD00161566.pdf; ComponentLink1Description: Manufacturer URL; ComponentLink2Description: Datasheet; PackageDescription: 48-Pin Low Profile Quad Flat Package, 7 x 7 mm Body, 0.5 mm Pitch
U2 U3 = CMP-0187-00133-3: None; Slew Rate: 0.6V/µs; Supply Current: 100uA; Power Supply Rejection Ratio (PSRR): 86dB; Input Offset Voltage (Vos): 4.5mV; Input Bias Current: 1pA; Amplifier Type: GENERAL PURPOSE; Unity Gain Bandwidth Product: 1MHz; Number of Circuits: 2; Output Current: 23mA; Operating Supply Voltage: 5.5V; Min Supply Voltage: 1.8V; Common Mode Rejection Ratio: 60dB; Voltage Gain: 112dB; Max Supply Voltage: 6V; Package Quantity: 60; REACH SVHC: No SVHC; Min Operating Temperature: -40°C; Max Operating Temperature: 125°C; Mount: Through Hole; Nominal Supply Current: 100uA; Height: 3.3mm; Length: 9.27mm; Slew Rate-Nom: 0.6V/µs; Packaging: Rail/Tube; Output Current per Channel: 23mA; Number of Amplifiers: 2; RoHS Compliant: Yes; Radiation Hardening: No; Bandwidth: 1MHz; Lead Free: Lead Free; Width: 6.35mm; Number of Channels: 2; Gain Bandwidth Product: 1MHz; Technology: CMOS; Operating Supply Current: 100uA; Number of Elements: 2; Number of Pins: 8; Input Offset Voltage-Max: 4.5mV; Case/Package: PDIP
U4 = CMP-12756-000035-1: IC REG LINEAR 3.3V 600MA SOT25; Number of Regulators: 1; Output Type: Fixed; Polarity: Positive; Min Input Voltage: 2.5V; Max Input Voltage: 6V; Accuracy: 1.5%; Quiescent Current: 55uA; Dropout Voltage: 250mV; Min Operating Temperature: -40°C; Length: 3.1mm; Output Current: 600mA; Max Operating Temperature: 85°C; Package Quantity: 1; Output Voltage: 3.3V; Width: 1.7mm; Number of Outputs: 1; Packaging: Tape and Reel; Height: 1.3mm; Lead Free: Lead Free; Max Output Current: 600mA; Case/Package: SOT-23-5; Mount: Surface Mount; Number of Pins: 5